# EasyEDA schematic Motor_Coil_Driver.json
TITLE: Demo Motor Coil Driver energy exhebition; REV: 1.0; Date: 2024-10-13; Sheet: 1/1; Drawn By: AmirB; Company: Your Company
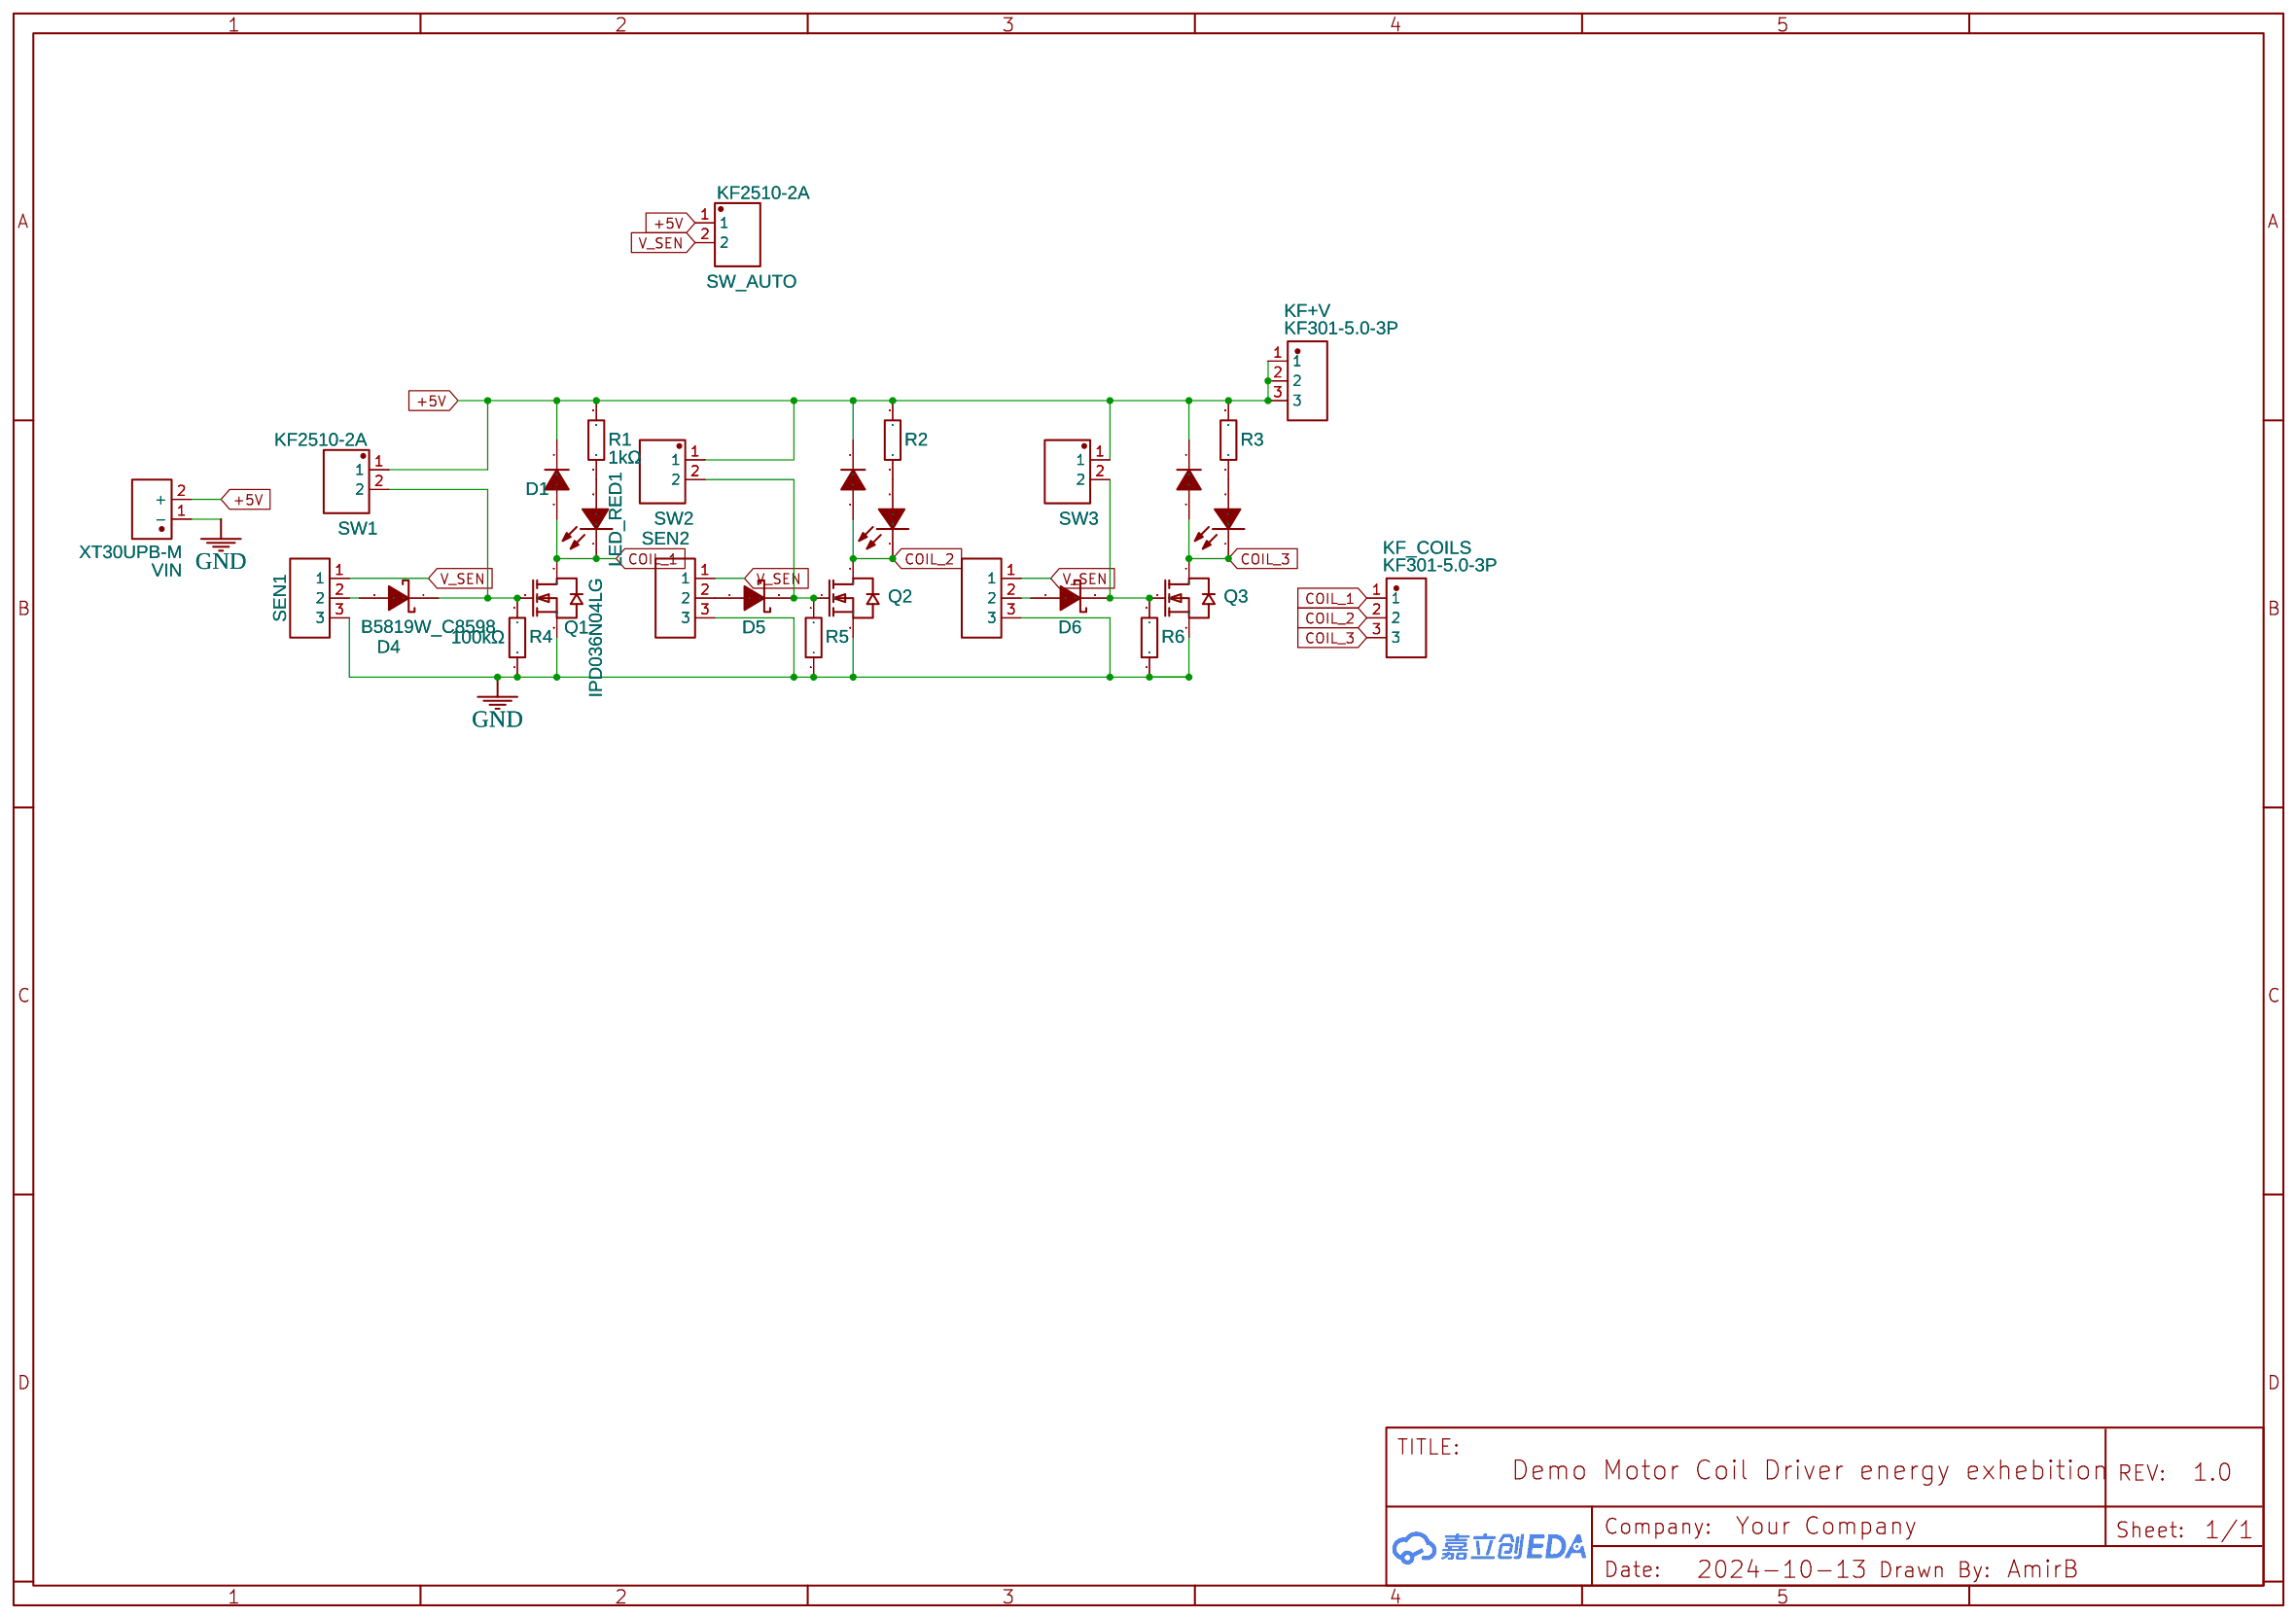
[diagram p0: schematic sheet]

## Parts
D1  SM4007PL  [SOD-123F_L2.8-W1.8-LS3.7-RD]
D2  SM4007PL  [SOD-123F_L2.8-W1.8-LS3.7-RD]
D3  SM4007PL  [SOD-123F_L2.8-W1.8-LS3.7-RD]
D4  B5819W_C8598  [SOD-123_L2.7-W1.6-LS3.7-RD-1]
D5  B5819W_C8598  [SOD-123_L2.7-W1.6-LS3.7-RD-1]
D6  B5819W_C8598  [SOD-123_L2.7-W1.6-LS3.7-RD-1]
KF+V  KF301-5.0-3P  [CONN-TH_3P-P5.00_KF301-5.0-3P]
KF_COILS  KF301-5.0-3P  [CONN-TH_3P-P5.00_KF301-5.0-3P]
LED_RED1  KT-0603R  [LED0603-RD]
LED_RED2  KT-0603R  [LED0603-RD]
LED_RED3  KT-0603R  [LED0603-RD]
Q1  IPD036N04LG  [TO-252-2_L6.6-W6.1-P4.58-LS9.9-BR]
Q2  IPD036N04LG  [TO-252-2_L6.6-W6.1-P4.58-LS9.9-BR]
Q3  IPD036N04LG  [TO-252-2_L6.6-W6.1-P4.58-LS9.9-BR]
R1  1kΩ  [R0603]
R2  1kΩ  [R0603]
R3  1kΩ  [R0603]
R4  100kΩ  [R0603]
R5  100kΩ  [R0603]
R6  100kΩ  [R0603]
SEN1  FK2510  [CONN-TH_3P-P2.00_KF2510_3A]
SEN2  FK2510  [CONN-TH_3P-P2.00_KF2510_3A]
SEN3  FK2510  [CONN-TH_3P-P2.00_KF2510_3A]
SW1  KF2510-2A  [CONN-TH_KF2510-2A]
SW2  KF2510-2A  [CONN-TH_KF2510-2A]
SW3  KF2510-2A  [CONN-TH_KF2510-2A]
SW_AUTO  KF2510-2A  [CONN-TH_KF2510-2A]
VIN  XT30UPB-M  [CONN-TH_XT30UPB-M]

## Library data of the parts
D1-D3 = SM4007PL: Supplier: LCSC; Manufacturer: MDD; Supplier Part: C64898; JLCPCB Part Class: Basic Part; Package Display: No
D4-D6 = B5819W_C8598: JLCPCB Part Class: Basic Part; Package Display: No
KF+V KF_COILS = KF301-5.0-3P: Contributor: LCSC; Supplier: LCSC; Supplier Part: C474882; Manufacturer: KEFA(科发); JLCPCB Part Class: Extended Part; Package Display: No
LED_RED1-LED_RED3 = KT-0603R: Supplier: LCSC; Manufacturer: KENTO; Supplier Part: C2286; JLCPCB Part Class: Basic Part; Package Display: No
Q1-Q3 = IPD036N04LG: Contributor: LCSC; Supplier: LCSC; Supplier Part: C878999; Manufacturer: VBsemi(微碧半导体); JLCPCB Part Class: Extended Part; Package Display: No
R1-R3 = RC0603FR-071KL: Supplier: LCSC; Manufacturer: YAGEO(国巨); Supplier Part: C22548; JLCPCB Part Class: Extended Part; Package Display: No
R4-R6 = 0603WAF1003T5E: Supplier: LCSC; Manufacturer: UNI-ROYAL(厚声); Supplier Part: C25803; JLCPCB Part Class: Basic Part; Package Display: No
SEN1-SEN3 = kf2510_3A: JLCPCB Part Class: Extended Part; Package Display: No
SW1-SW3 SW_AUTO = KF2510-2A: Supplier: LCSC; Manufacturer: BOOMELE; Supplier Part: C27543; JLCPCB Part Class: Extended Part; Package Display: No
VIN = XT30UPB-M: Contributor: LCSC; JLCPCB Part Class: Extended Part; Package Display: No

## Nets
+5V: D1.1(C) D2.1(C) D3.1(C) KF+V.1 KF+V.2 KF+V.3 R1.2 R2.2 R3.2 SW1.1 SW2.1 SW3.1 SW_AUTO.1 VIN.2(+)
GND: Q1.3(S) Q2.3(S) Q3.3(S) R4.1 R5.1 R6.1 SEN1.3 SEN2.3 SEN3.3 VIN.1(-)
COIL_1: D1.2(A) KF_COILS.1 LED_RED1.1(K) Q1.2(D)
COIL_2: D2.2(A) KF_COILS.2 LED_RED2.1(K) Q2.2(D)
COIL_3: D3.2(A) KF_COILS.3 LED_RED3.1(K) Q3.2(D)
V_SEN: SEN1.1 SEN2.1 SEN3.1 SW_AUTO.2
Net-(D4-1): D4.1(-) Q1.1(G) R4.2 SW1.2
Net-(D4-2): D4.2(+) SEN1.2
Net-(D5-1): D5.1(-) Q2.1(G) R5.2 SW2.2
Net-(D5-2): D5.2(+) SEN2.2
Net-(D6-1): D6.1(-) Q3.1(G) R6.2 SW3.2
Net-(D6-2): D6.2(+) SEN3.2
Net-(LED_RED1-2): LED_RED1.2(A) R1.1
Net-(LED_RED2-2): LED_RED2.2(A) R2.1
Net-(LED_RED3-2): LED_RED3.2(A) R3.1
